# Altium schematic sheet PE44820B_DEV_BOARD.SchDoc
size A4; SheetNumber: 1; SheetTotal: 1
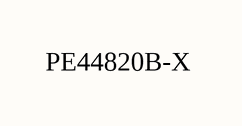
[diagram p0: PE44820B_DEV_BOARD.SchDoc]

## Notes on the sheet
- PE44820B-X